# EasyEDA schematic Carte thermostat.json
TITLE: Carte Thermostat; REV: 1.0; Date: 2021-03-20; Sheet: 1/1; Drawn By: nipil; Company: Atlantic
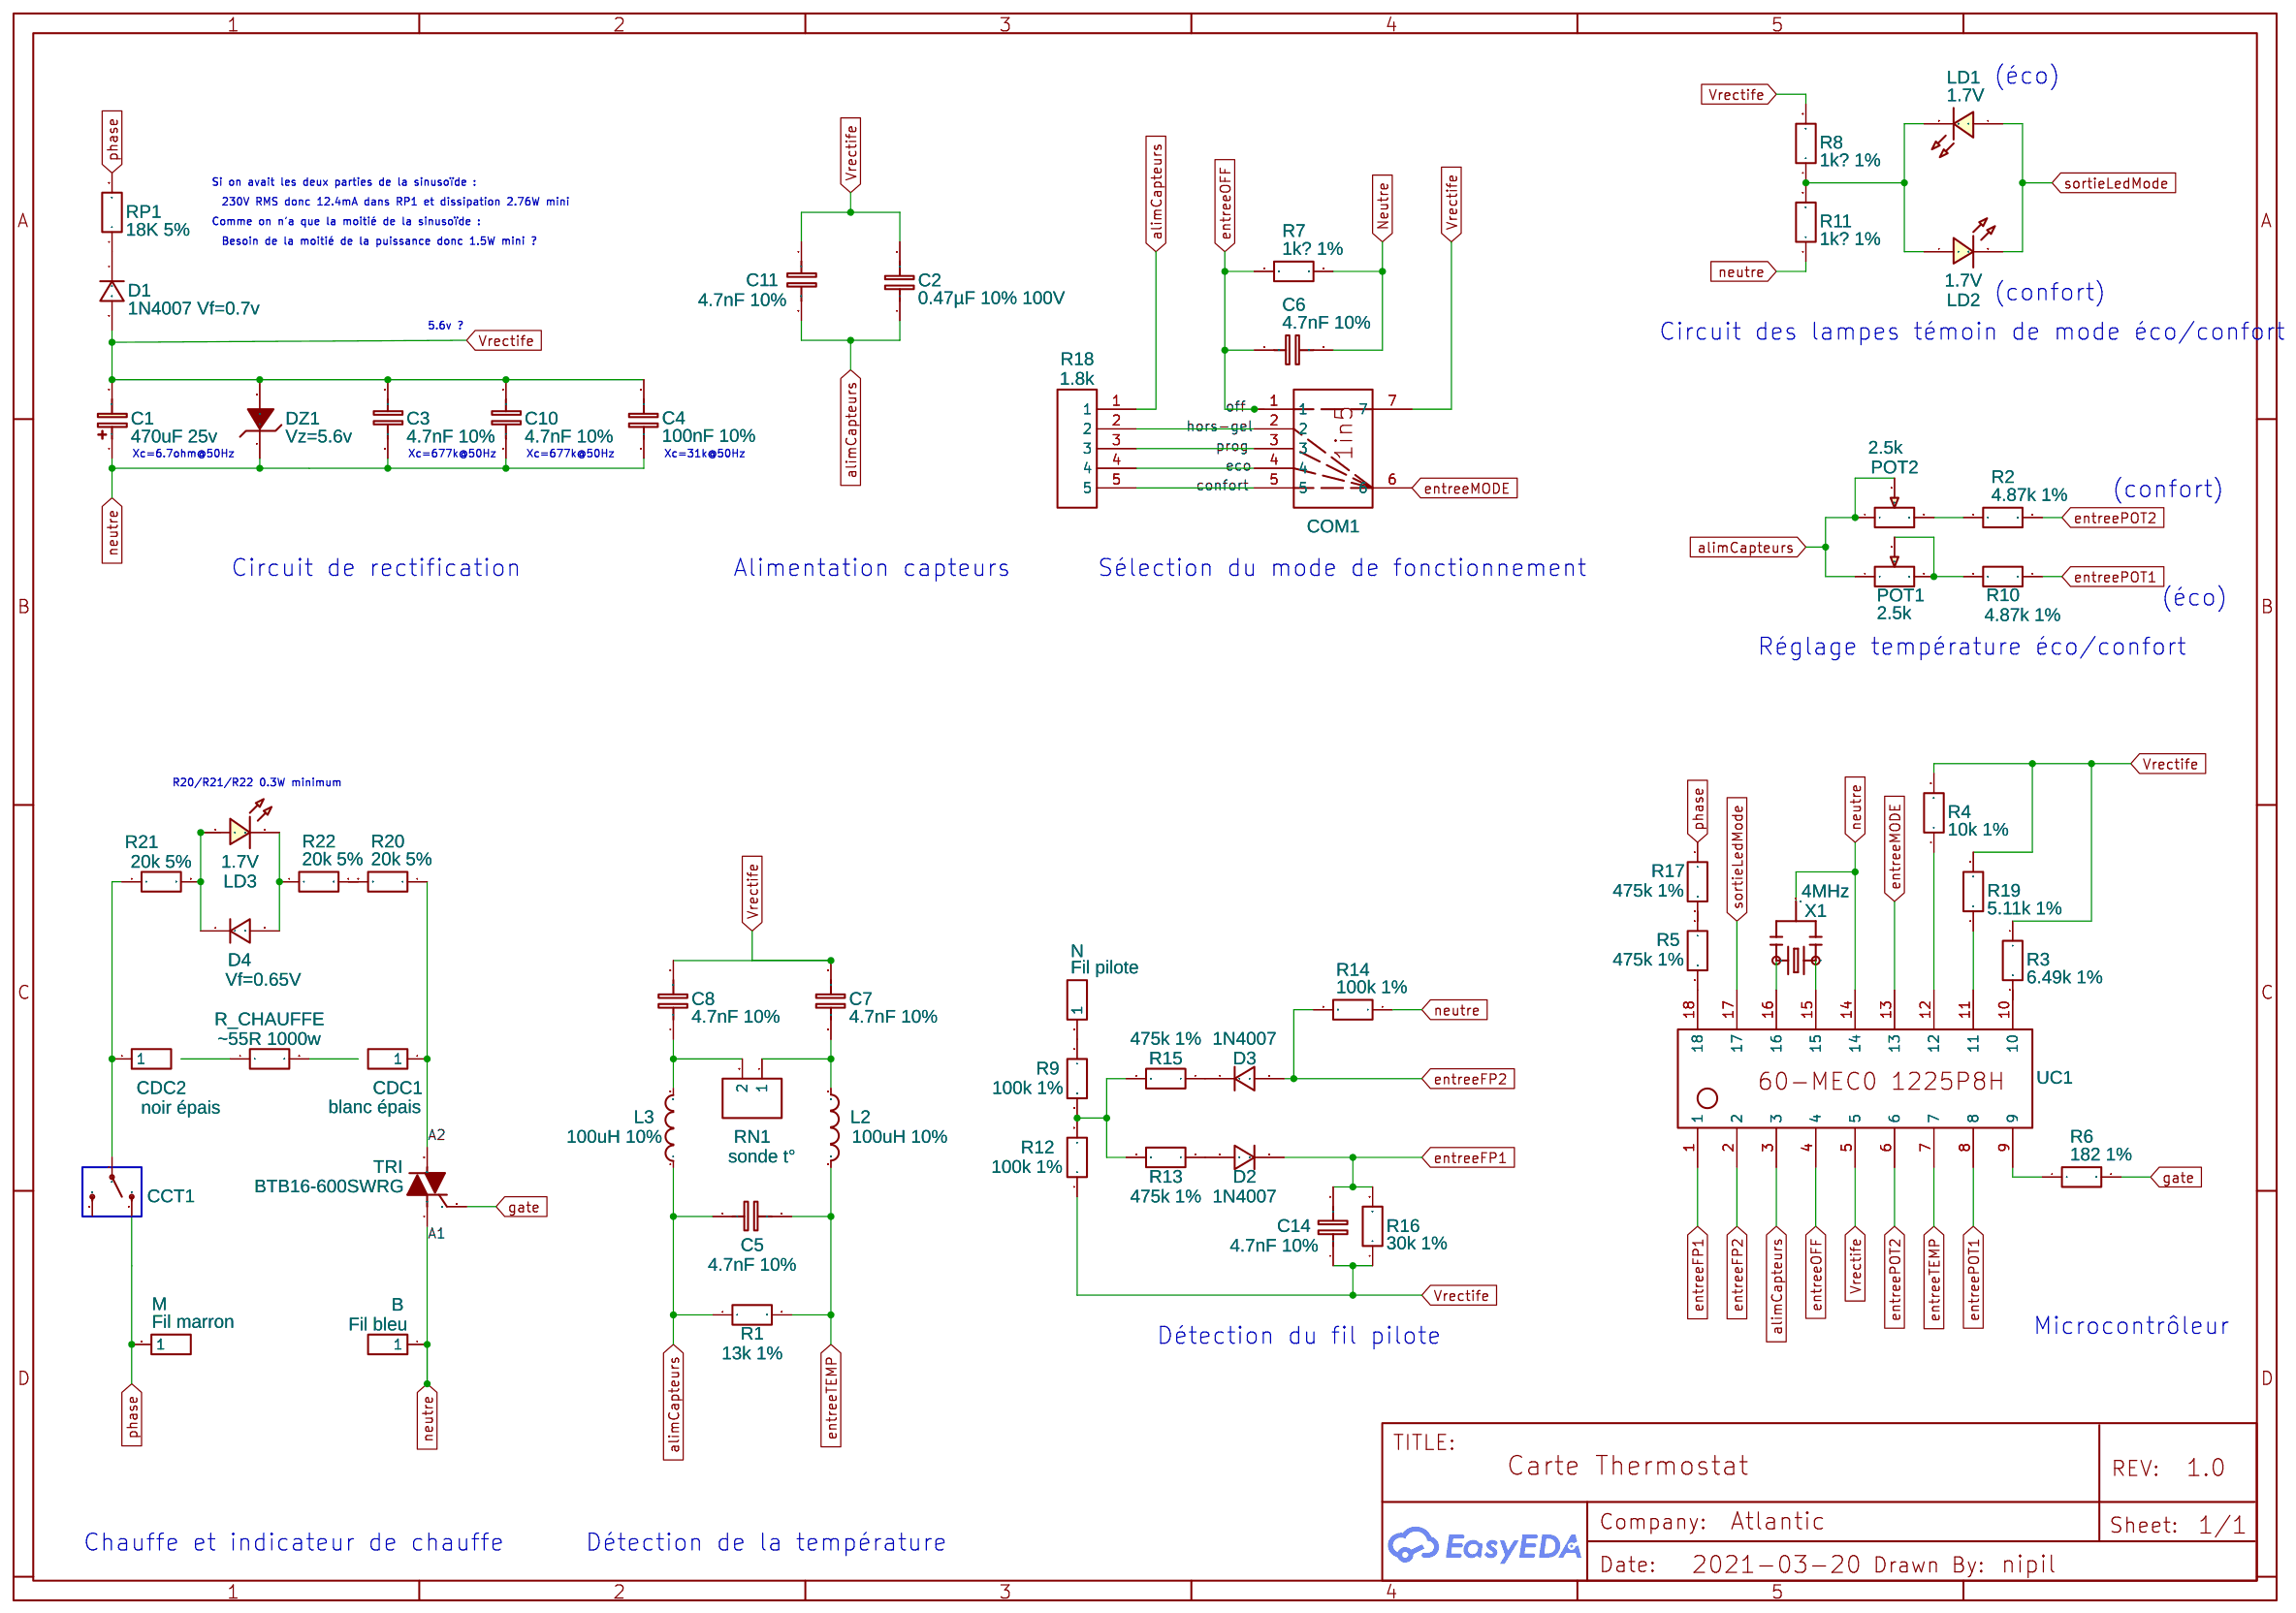
[diagram p0: schematic sheet]

## Parts
B  Fil bleu  [HDR-M-2.54_1X1]
C1  470uF 25v  [CASE-A_3216]
C2  0.47µF 10% 100V  [C0603]
C3  4.7nF 10%  [C0603]
C4  100nF 10%  [C0603]
C5  4.7nF 10%  [C0603]
C6  4.7nF 10%  [C0603]
C7  4.7nF 10%  [C0603]
C8  4.7nF 10%  [C0603]
C10  4.7nF 10%  [C0603]
C11  4.7nF 10%  [C0603]
C14  4.7nF 10%  [C0603]
CCT1  NC thermal switch  [SWITCH-SPDT]
CDC1  blanc épais  [HDR-M-2.54_1X1]
CDC2  noir épais  [HDR-M-2.54_1X1]
COM1  ?
D1  1N4007 Vf=0.7v  [SOD-123_L2.8-W1.8-LS3.7-RD]
D2  1N4007  [SOD-123_L2.8-W1.8-LS3.7-RD]
D3  1N4007  [SOD-123_L2.8-W1.8-LS3.7-RD]
D4  Vf=0.65V  [SOD-123_L2.8-W1.8-LS3.7-RD]
DZ1  Vz=5.6v  [DO-41_BD2.4-L4.7-P8.70-D0.9-RD]
L2  100uH 10%  [L0603]
L3  100uH 10%  [L0603]
LD1  1.7V  [LED0603_RED]
LD2  1.7V  [LED0603_RED]
LD3  1.7V  [LED0603_RED]
M  Fil marron  [HDR-M-2.54_1X1]
N  Fil pilote  [HDR-M-2.54_1X1]
POT1  2.5k  [RES-ADJ-TH_3386P]
POT2  2.5k  [RES-ADJ-TH_3386P]
R1  13k 1%  [R1210]
R2  4.87k 1%  [R1210]
R3  6.49k 1%  [R1210]
R4  10k 1%  [R1210]
R5  475k 1%  [R1210]
R6  182 1%  [R1210]
R7  1k? 1%  [R1210]
R8  1k? 1%  [R1210]
R9  100k 1%  [R1210]
R10  4.87k 1%  [R1210]
R11  1k? 1%  [R1210]
R12  100k 1%  [R1210]
R13  475k 1%  [R1210]
R14  100k 1%  [R1210]
R15  475k 1%  [R1210]
R16  30k 1%  [R1210]
R17  475k 1%  [R1210]
R18  1.8k
R19  5.11k 1%  [R1210]
R20  20k 5%  [R1210]
R21  20k 5%  [R1210]
R22  20k 5%  [R1210]
R_CHAUFFE  55R 1000w  [R1210]
RN1  sonde t°  [CONN-TH_2P-P5.00]
RP1  18K 5%  [R1210]
TRI  BTB16-600SWRG  [TO-220-3_L10.0-W4.5-P2.54-L]
UC1  60-MEC0 1225P8H
X1  4MHz  [RESONATOR-PTH]

## Library data of the parts
B CDC1 CDC2 M N = HDR-M-2.54_1x1: Supplier Part: C81276; Supplier: LCSC; Contributor: LCEDA_Lib
C1 = C_Tan_SMD_A_EU: Contributor: LCEDA_Lib
C2-C8 C10 C11 C14 = C_0603_EU: Contributor: LCEDA_Lib
CCT1 = SWITCH-SPDT: Contributor: SparkFun
COM1 = off_4modes_selector: Contributor: nipil
D1-D4 = 1N4007W: Supplier: LCSC; Supplier Part: C328592; Manufacturer: BLUE ROCKET; Contributor: LCEDA_Lib
DZ1 = 1N4748A-TAP: Supplier: LCSC; Supplier Part: C241987; Manufacturer: Vishay Intertech; Contributor: LCSC; LCSC Assembly: Yes; SMT Type: Extend; Paste Type: expand
L2 L3 = L0603_US: Contributor: LCEDA_Lib
LD1-LD3 = LED-0603_R: Manufacturer: EVERLIGHT(台湾亿光); Manufacturer Part: 19-217/R6C-AL1M2VY/3T; Supplier Part: C72044; Supplier: LCSC; Contributor: LCEDA_01
POT1 POT2 = R_3386P_EU: Supplier: LCSC; Contributor: LCEDA_Lib; Value(Ω): 10K
R1-R17 R19-R22 R_CHAUFFE RP1 = R_1210_EU: Contributor: LCEDA_Lib
R18 = series_resistor: Contributor: nipil
RN1 = CONN-TH_2P-P5.00: Supplier: LCSC; Contributor: LCEDA_Lib
TRI = BTB16-600CWRG: Supplier: LCSC; Manufacturer: STMicroelectronics; image: //image.lceda.cn/szlcsc/C77576.jpg; Supplier Part: C77576; LCSC Assembly: Yes; SMT Type: Extend; Paste Type: expand
UC1 = 60-MEC0 1225P8H: Contributor: nipil
X1 = RESONATORPTH: Resonator; Contributor: SparkFun

## Nets
A1: B.1 C1.1 C3.2 C4.1 C10.2 DZ1.1(K) R11.1 R14.1 TRI.1(A1) UC1.14 X1.2
A2: CDC1.1 R20.1 TRI.2(A2)
alimCapteurs: C2.1 C5.1 C11.2 L3.1 POT1.1 POT2.1 POT2.2 R1.1 R18.1 UC1.3
confort: COM1.5 R18.5
eco: COM1.4 R18.4
entreeFP1: C14.2 D2.1 R16.2 UC1.1
entreeFP2: D3.2 R14.2 UC1.2
entreeMODE: COM1.6 UC1.13
entreeOFF: C6.1 COM1.1 R7.1 UC1.4
entreePOT1: R10.1 UC1.8
entreePOT2: R2.2 UC1.6
entreeTEMP: C5.2 L2.2 R1.2 UC1.7
gate: R6.2 TRI.3(G)
hors-gel: COM1.2 R18.2
Neutre: C6.2 R7.2
phase: CCT1.1(O) M.1 R17.1 RP1.2
prog: COM1.3 R18.3
sortieLedMode: LD1.1 LD2.2 UC1.17
Vrectife: C1.2 C2.2 C3.1 C4.2 C7.2 C8.2 C10.1 C11.1 C14.1 COM1.7 D1.2 DZ1.2(A) R3.1 R4.2 R8.2 R12.1 R16.1 R19.2 UC1.5
Net-(C7-1): C7.1 L2.1 RN1.1
Net-(C8-1): C8.1 L3.2 RN1.2
Net-(CCT1-2): CCT1.2(P) CDC2.1 R21.1
Net-(D1-1): D1.1 RP1.1
Net-(D2-2): D2.2 R13.1
Net-(D3-1): D3.1 R15.1
Net-(D4-1): D4.1 LD3.1 R21.2
Net-(D4-2): D4.2 LD3.2 R22.1
Net-(LD1-2): LD1.2 LD2.1 R8.1 R11.2
Net-(N-1): N.1 R9.1
Net-(POT1-2): POT1.2 POT1.3 R10.2
Net-(POT2-3): POT2.3 R2.1
Net-(R4-1): R4.1 UC1.12
Net-(R5-2): R5.2 UC1.18
Net-(R6-1): R6.1 UC1.9
Net-(R9-2): R9.2 R12.2 R13.2 R15.2
Net-(R19-1): R19.1 UC1.11
Net-(R20-2): R20.2 R22.2
Net-(UC1-15): UC1.15 X1.1
Net-(UC1-16): UC1.16 X1.3

Not connected (* = marked no-connect by the designer): CCT1 3(S); R3 2; R5 1; R17 2; R_CHAUFFE 1 2; UC1 10

## Notes on the sheet
- (éco)
- Si on avait les deux parties de la sinusoïde :
- 230V RMS donc 12.4mA dans RP1 et dissipation 2.76W mini
- Comme on n'a que la moitié de la sinusoïde :
- Besoin de la moitié de la puissance donc 1.5W mini ?
- (confort)
- 5.6v ?
- Circuit des lampes témoin de mode éco/confort
- Xc=6.7ohm@50Hz
- Xc=677k@50Hz
- Xc=677k@50Hz
- Xc=31k@50Hz
- (confort)
- Circuit de rectification
- Alimentation capteurs
- Sélection du mode de fonctionnement
- (éco)
- Réglage température éco/confort
- R20/R21/R22 0.3W minimum
- Détection du fil pilote
- Microcontrôleur
- Chauffe et indicateur de chauffe
- Détection de la température
